# EasyEDA schematic SCH_CJ4-lights-panel.json
TITLE: CJ4 Lights panel; REV: 1.0; Date: 2021-07-25; Sheet: 1/1; Drawn By: tuomas.kuosmanen; Company: Your Company
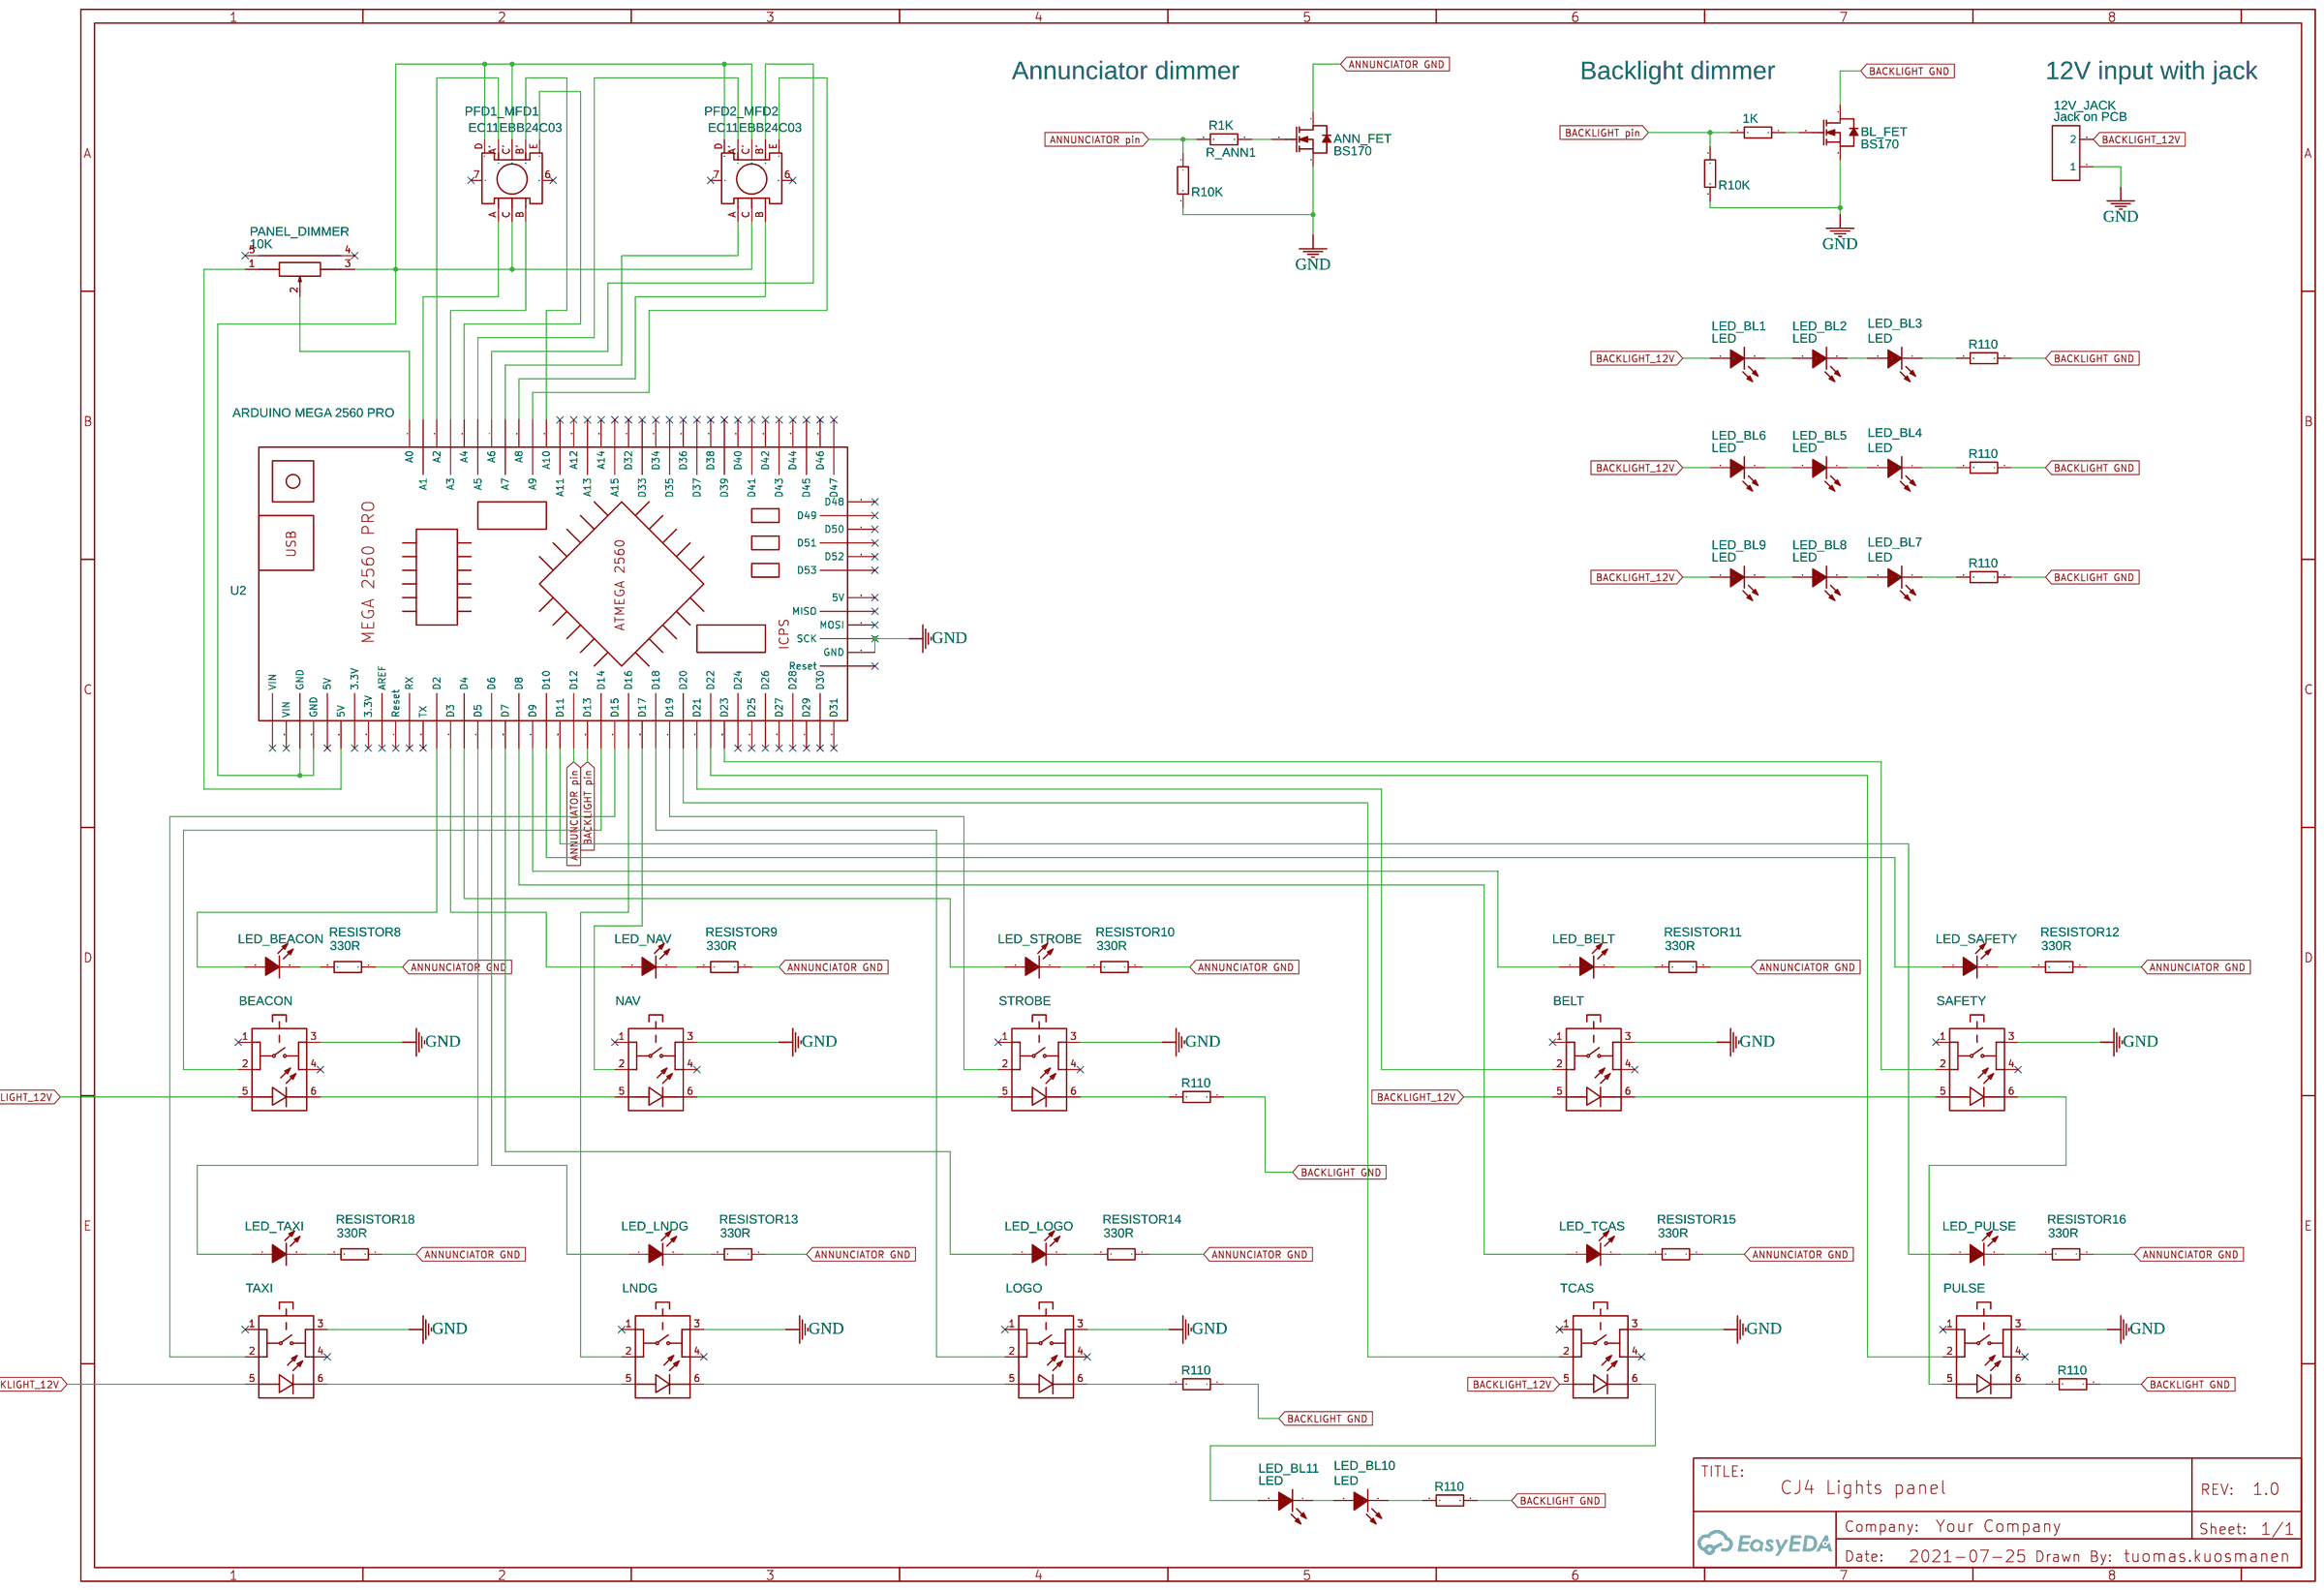
[diagram p0: schematic sheet]

## Parts
1MM_LED_THROUGH_HOLE  LED_TAXI  [LED-TH_BD3.8-P2.54-FD]
2MM_LED_THROUGH_HOLE  LED_LNDG  [LED-TH_BD3.8-P2.54-FD]
3MM_LED_THROUGH_HOLE  LED_NAV  [LED-TH_BD3.8-P2.54-FD]
4MM_LED_THROUGH_HOLE  LED_LOGO  [LED-TH_BD3.8-P2.54-FD]
5MM_LED_THROUGH_HOLE  LED_BEACON  [LED-TH_BD3.8-P2.54-FD]
6MM_LED_THROUGH_HOLE  LED_STROBE  [LED-TH_BD3.8-P2.54-FD]
7MM_LED_THROUGH_HOLE  LED_SAFETY  [LED-TH_BD3.8-P2.54-FD]
8MM_LED_THROUGH_HOLE  LED_PULSE  [LED-TH_BD3.8-P2.54-FD]
9MM_LED_THROUGH_HOLE  LED_BELT  [LED-TH_BD3.8-P2.54-FD]
10MM_LED_THROUGH_HOLE  LED_TCAS  [LED-TH_BD3.8-P2.54-FD]
12V_JACK  Jack on PCB  [JACK ON PCB]
ANN_FET  BS170  [TO-92-3_L4.9-W3.7-P1.27-L]
BL_FET  BS170  [TO-92-3_L4.9-W3.7-P1.27-L]
HEADING_HOLD1  BEACON  [MULTIMEC 3FTH980 - KEY SWITCH, 50 MA, 24 VDC, MEC]
HEADING_HOLD2  TAXI  [MULTIMEC 3FTH980 - KEY SWITCH, 50 MA, 24 VDC, MEC]
HEADING_HOLD3  LNDG  [MULTIMEC 3FTH980 - KEY SWITCH, 50 MA, 24 VDC, MEC]
HEADING_HOLD4  NAV  [MULTIMEC 3FTH980 - KEY SWITCH, 50 MA, 24 VDC, MEC]
HEADING_HOLD5  LOGO  [MULTIMEC 3FTH980 - KEY SWITCH, 50 MA, 24 VDC, MEC]
HEADING_HOLD6  STROBE  [MULTIMEC 3FTH980 - KEY SWITCH, 50 MA, 24 VDC, MEC]
HEADING_HOLD7  SAFETY  [MULTIMEC 3FTH980 - KEY SWITCH, 50 MA, 24 VDC, MEC]
HEADING_HOLD8  PULSE  [MULTIMEC 3FTH980 - KEY SWITCH, 50 MA, 24 VDC, MEC]
HEADING_HOLD9  BELT  [MULTIMEC 3FTH980 - KEY SWITCH, 50 MA, 24 VDC, MEC]
HEADING_HOLD10  TCAS  [MULTIMEC 3FTH980 - KEY SWITCH, 50 MA, 24 VDC, MEC]
LED_BL1  LED  [LED1206-RD]
LED_BL2  LED  [LED1206-RD]
LED_BL3  LED  [LED1206-RD]
LED_BL4  LED  [LED1206-RD]
LED_BL5  LED  [LED1206-RD]
LED_BL6  LED  [LED1206-RD]
LED_BL7  LED  [LED1206-RD]
LED_BL8  LED  [LED1206-RD]
LED_BL9  LED  [LED1206-RD]
LED_BL10  LED  [LED1206-RD]
LED_BL11  LED  [LED1206-RD]
PANEL_DIMMER  10K  [RES-TH_RK09K1130A70]
PFD1_MFD1  EC11EBB24C03  [SW-TH_EC11EBB24C03]
PFD2_MFD2  EC11EBB24C03  [SW-TH_EC11EBB24C03]
PROTECT_BL1  1K  [R1206]
R_ANN1  R1K  [R1206]
R_ANN2  R10K  [R1206]
R_ANN5  R10K  [R1206]
R_BL1  R110  [R1206]
R_BL2  R110  [R1206]
R_BL3  R110  [R1206]
R_BL4  R110  [R1206]
R_BL5  R110  [R1206]
R_BL6  R110  [R1206]
R_BL7  R110  [R1206]
RESISTOR8  330R  [R1206]
RESISTOR9  330R  [R1206]
RESISTOR10  330R  [R1206]
RESISTOR11  330R  [R1206]
RESISTOR12  330R  [R1206]
RESISTOR13  330R  [R1206]
RESISTOR14  330R  [R1206]
RESISTOR15  330R  [R1206]
RESISTOR16  330R  [R1206]
RESISTOR18  330R  [R1206]
U2  ARDUINO MEGA 2560 PRO  [ARDUINO MEGA 2560 PRO]

## Library data of the parts
1MM_LED_THROUGH_HOLE 2MM_LED_THROUGH_HOLE 3MM_LED_THROUGH_HOLE 4MM_LED_THROUGH_HOLE 5MM_LED_THROUGH_HOLE 6MM_LED_THROUGH_HOLE 7MM_LED_THROUGH_HOLE 8MM_LED_THROUGH_HOLE 9MM_LED_THROUGH_HOLE 10MM_LED_THROUGH_HOLE = LEDOrange orange 3AO4UD: Supplier: LCSC; Manufacturer: KENTO; Supplier Part: C62095
12V_JACK = J-Header-Male-2.54_1x2: Manufacturer: TE Connectivity; image: //image.lceda.cn/szlcsc/C86471.jpg; link: //image.lceda.cn/szlcsc/C86471.jpg; Package Display: No
ANN_FET BL_FET = BS170: Supplier: LCSC; Manufacturer: FAIRCHILD; Supplier Part: C111691; JLCPCB Part Class: Extended Part
HEADING_HOLD1-HEADING_HOLD10 = MULTIMEC 3FTH980 - Key Switch, 50 mA, 24 VDC, MEC: Manufacturer Part: 1052612; link: https://www.elfadistrelec.no/Web/Downloads/he/et/3A3F4F_eng_datasheet.pdf; Contributor: smund3
LED_BL1-LED_BL11 = HQ17-2102UYOC: Supplier: LCSC; Manufacturer: HARVATEK; Contributor: LCSC; Supplier Part: C154481; JLCPCB Part Class: Extended Part
PANEL_DIMMER = RK09K1130A70: Supplier: LCSC; Supplier Part: C351173; Manufacturer: ALPS Electric; Contributor: LCSC; JLCPCB Part Class: Extended Part
PFD1_MFD1 PFD2_MFD2 = EC11EBB24C03: Supplier: LCSC; Supplier Part: C470790; Manufacturer: ALPS Electric; Contributor: LCSC; JLCPCB Part Class: Extended Part
PROTECT_BL1 R_ANN1 R_ANN2 R_ANN5 R_BL1-R_BL7 RESISTOR8-RESISTOR16 RESISTOR18 = 1206W4J0331T5E: Supplier: LCSC; Manufacturer: UniOhm; Supplier Part: C25374
U2 = ARDUINO MEGA 2560 PRO: Manufacturer Part: Arduino Mega 2560 Pro Mini; link: https://robotdyn.com/mega-2560-pro-embed-ch340g-atmega2560-16au.html; Contributor: DEVAZ

## Nets
GND: 12V_JACK.1 ANN_FET.3(S) BL_FET.3(S) HEADING_HOLD1.3 HEADING_HOLD2.3 HEADING_HOLD3.3 HEADING_HOLD4.3 HEADING_HOLD5.3 HEADING_HOLD6.3 HEADING_HOLD7.3 HEADING_HOLD8.3 HEADING_HOLD9.3 HEADING_HOLD10.3 R_ANN2.2 R_ANN5.2 U2.42(SCK) U2.43(GND)
ANNUNCIATOR GND: ANN_FET.1(D) RESISTOR8.1 RESISTOR9.1 RESISTOR10.1 RESISTOR11.1 RESISTOR12.1 RESISTOR13.1 RESISTOR14.1 RESISTOR15.1 RESISTOR16.1 RESISTOR18.1
ANNUNCIATOR pin: R_ANN1.2 R_ANN2.1 U2.64(D12)
BACKLIGHT GND: BL_FET.1(D) R_BL1.1 R_BL2.1 R_BL3.1 R_BL4.1 R_BL5.1 R_BL6.1 R_BL7.1
BACKLIGHT pin: PROTECT_BL1.2 R_ANN5.1 U2.63(D13)
BACKLIGHT_12V: 12V_JACK.2 HEADING_HOLD1.5(2) HEADING_HOLD2.5(2) HEADING_HOLD9.5(2) HEADING_HOLD10.5(2) LED_BL1.2(A) LED_BL6.2(A) LED_BL9.2(A)
Net-(1MM_LED_THROUGH_HOLE-1): 1MM_LED_THROUGH_HOLE.1(A) U2.71(D5)
Net-(1MM_LED_THROUGH_HOLE-2): 1MM_LED_THROUGH_HOLE.2(K) RESISTOR18.2
Net-(2MM_LED_THROUGH_HOLE-1): 2MM_LED_THROUGH_HOLE.1(A) U2.70(D6)
Net-(2MM_LED_THROUGH_HOLE-2): 2MM_LED_THROUGH_HOLE.2(K) RESISTOR13.2
Net-(3MM_LED_THROUGH_HOLE-1): 3MM_LED_THROUGH_HOLE.1(A) U2.73(D3)
Net-(3MM_LED_THROUGH_HOLE-2): 3MM_LED_THROUGH_HOLE.2(K) RESISTOR9.2
Net-(4MM_LED_THROUGH_HOLE-1): 4MM_LED_THROUGH_HOLE.1(A) U2.69(D7)
Net-(4MM_LED_THROUGH_HOLE-2): 4MM_LED_THROUGH_HOLE.2(K) RESISTOR14.2
Net-(5MM_LED_THROUGH_HOLE-1): 5MM_LED_THROUGH_HOLE.1(A) U2.74(D2)
Net-(5MM_LED_THROUGH_HOLE-2): 5MM_LED_THROUGH_HOLE.2(K) RESISTOR8.2
Net-(6MM_LED_THROUGH_HOLE-1): 6MM_LED_THROUGH_HOLE.1(A) U2.72(D4)
Net-(6MM_LED_THROUGH_HOLE-2): 6MM_LED_THROUGH_HOLE.2(K) RESISTOR10.2
Net-(7MM_LED_THROUGH_HOLE-1): 7MM_LED_THROUGH_HOLE.1(A) U2.66(D10)
Net-(7MM_LED_THROUGH_HOLE-2): 7MM_LED_THROUGH_HOLE.2(K) RESISTOR12.2
Net-(8MM_LED_THROUGH_HOLE-1): 8MM_LED_THROUGH_HOLE.1(A) U2.65(D11)
Net-(8MM_LED_THROUGH_HOLE-2): 8MM_LED_THROUGH_HOLE.2(K) RESISTOR16.2
Net-(9MM_LED_THROUGH_HOLE-1): 9MM_LED_THROUGH_HOLE.1(A) U2.67(D9)
Net-(9MM_LED_THROUGH_HOLE-2): 9MM_LED_THROUGH_HOLE.2(K) RESISTOR11.2
Net-(10MM_LED_THROUGH_HOLE-1): 10MM_LED_THROUGH_HOLE.1(A) U2.68(D8)
Net-(10MM_LED_THROUGH_HOLE-2): 10MM_LED_THROUGH_HOLE.2(K) RESISTOR15.2
Net-(ANN_FET-2): ANN_FET.2(G) R_ANN1.1
Net-(BL_FET-2): BL_FET.2(G) PROTECT_BL1.1
Net-(HEADING_HOLD1-2): HEADING_HOLD1.2 U2.62(D14)
Net-(HEADING_HOLD1-6): HEADING_HOLD1.6(4) HEADING_HOLD4.5(2)
Net-(HEADING_HOLD2-2): HEADING_HOLD2.2 U2.61(D15)
Net-(HEADING_HOLD2-6): HEADING_HOLD2.6(4) HEADING_HOLD3.5(2)
Net-(HEADING_HOLD3-2): HEADING_HOLD3.2 U2.60(D16)
Net-(HEADING_HOLD3-6): HEADING_HOLD3.6(4) HEADING_HOLD5.5(2)
Net-(HEADING_HOLD4-2): HEADING_HOLD4.2 U2.59(D17)
Net-(HEADING_HOLD4-6): HEADING_HOLD4.6(4) HEADING_HOLD6.5(2)
Net-(HEADING_HOLD5-2): HEADING_HOLD5.2 U2.58(D18)
Net-(HEADING_HOLD5-6): HEADING_HOLD5.6(4) R_BL6.2
Net-(HEADING_HOLD6-2): HEADING_HOLD6.2 U2.57(D19)
Net-(HEADING_HOLD6-6): HEADING_HOLD6.6(4) R_BL5.2
Net-(HEADING_HOLD7-2): HEADING_HOLD7.2 U2.53(D23)
Net-(HEADING_HOLD7-5): HEADING_HOLD7.5(2) HEADING_HOLD9.6(4)
Net-(HEADING_HOLD7-6): HEADING_HOLD7.6(4) HEADING_HOLD8.5(2)
Net-(HEADING_HOLD8-2): HEADING_HOLD8.2 U2.54(D22)
Net-(HEADING_HOLD8-6): HEADING_HOLD8.6(4) R_BL7.2
Net-(HEADING_HOLD9-2): HEADING_HOLD9.2 U2.55(D21)
Net-(HEADING_HOLD10-2): HEADING_HOLD10.2 U2.56(D20)
Net-(HEADING_HOLD10-6): HEADING_HOLD10.6(4) LED_BL11.2(A)
Net-(LED_BL1-1): LED_BL1.1(K) LED_BL2.2(A)
Net-(LED_BL2-1): LED_BL2.1(K) LED_BL3.2(A)
Net-(LED_BL3-1): LED_BL3.1(K) R_BL1.2
Net-(LED_BL4-1): LED_BL4.1(K) R_BL2.2
Net-(LED_BL4-2): LED_BL4.2(A) LED_BL5.1(K)
Net-(LED_BL5-2): LED_BL5.2(A) LED_BL6.1(K)
Net-(LED_BL7-1): LED_BL7.1(K) R_BL3.2
Net-(LED_BL7-2): LED_BL7.2(A) LED_BL8.1(K)
Net-(LED_BL8-2): LED_BL8.2(A) LED_BL9.1(K)
Net-(LED_BL10-1): LED_BL10.1(K) R_BL4.2
Net-(LED_BL10-2): LED_BL10.2(A) LED_BL11.1(K)
Net-(PANEL_DIMMER-1): PANEL_DIMMER.1 U2.81(5V)
Net-(PANEL_DIMMER-2): PANEL_DIMMER.2 U2.1(A0)
Net-(PANEL_DIMMER-3): PANEL_DIMMER.3 PFD1_MFD1.C PFD1_MFD1.C' PFD1_MFD1.D PFD2_MFD2.C PFD2_MFD2.C' PFD2_MFD2.D U2.83(GND) U2.84(GND)
Net-(PFD1_MFD1-A'): PFD1_MFD1.A' U2.3(A2)
Net-(PFD1_MFD1-A): PFD1_MFD1.A U2.2(A1)
Net-(PFD1_MFD1-B'): PFD1_MFD1.B' U2.11(A10)
Net-(PFD1_MFD1-B): PFD1_MFD1.B U2.4(A3)
Net-(PFD1_MFD1-E): PFD1_MFD1.E U2.5(A4)
Net-(PFD2_MFD2-A'): PFD2_MFD2.A' U2.6(A5)
Net-(PFD2_MFD2-A): PFD2_MFD2.A U2.8(A7)
Net-(PFD2_MFD2-B'): PFD2_MFD2.B' U2.7(A6)
Net-(PFD2_MFD2-B): PFD2_MFD2.B U2.9(A8)
Net-(PFD2_MFD2-E): PFD2_MFD2.E U2.10(A9)

Not connected (* = marked no-connect by the designer): HEADING_HOLD1 1* 4*; HEADING_HOLD2 1* 4*; HEADING_HOLD3 1* 4*; HEADING_HOLD4 1* 4*; HEADING_HOLD5 1* 4*; HEADING_HOLD6 1* 4*; HEADING_HOLD7 1* 4*; HEADING_HOLD8 1* 4*; HEADING_HOLD9 1* 4*; HEADING_HOLD10 1* 4*; PANEL_DIMMER 4(EH)* 5(EH)*; PFD1_MFD1 6* 7*; PFD2_MFD2 6* 7*; U2 12(A11)* 13(A12)* 14(A13)* 15(A14)* 16(A15)* 17(D32)* 18(D33)* 19(D34)* 20(D35)* 21(D36)* 22(D37)* 23(D38)* 24(D39)* 25(D40)* 26(D41)* 27(D42)* 28(D43)* 29(D44)* 30(D45)* 31(D46)* 32(D47)* 33(D48)* 34(D49)* 35(D50)* 36(D51)* 37(D52)* 38(D53)* 39(5V)* 40(MISO)* 41(MOSI)* 44(Reset)* 45(D31)* 46(D30)* 47(D29)* 48(D28)* 49(D27)* 50(D26)* 51(D25)* 52(D24)* 75(TX)* 76(RX)* 77(Reset)* 78(AREF)* 79(3.3V)* 80(3.3V)* 82(5V)* 85(VIN)* 86(VIN)*

## Notes on the sheet
- Annunciator dimmer
- Backlight dimmer
- 12V input with jack
